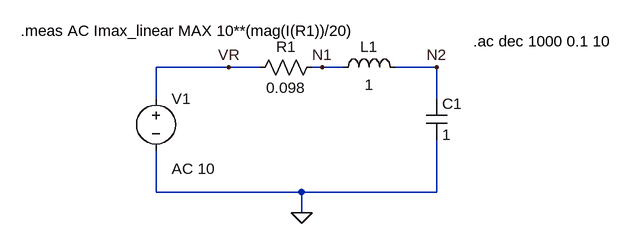
[diagram p0: schematic AC Resistance.asc]
AC Resistance.asc, the LTspice schematic file:
Version 4.1
SHEET 1 916 680
WIRE 96 16 -16 16
WIRE 144 16 96 16
WIRE 240 16 224 16
WIRE 272 16 240 16
WIRE 416 16 352 16
WIRE -16 64 -16 16
WIRE 416 64 416 16
WIRE -16 208 -16 144
WIRE 208 208 -16 208
WIRE 416 208 416 128
WIRE 416 208 208 208
WIRE 208 240 208 208
FLAG 208 240 0
FLAG 240 16 N1
FLAG 416 16 N2
FLAG 96 16 VR
SYMBOL voltage -16 48 R0
WINDOW 123 24 124 Left 2
WINDOW 39 0 0 Left 0
SYMATTR InstName V1
SYMATTR Value ""
SYMATTR Value2 AC 10
SYMBOL res 240 0 R90
WINDOW 0 0 56 VBottom 2
WINDOW 3 32 56 VTop 2
SYMATTR InstName R1
SYMATTR Value 0.098
SYMBOL cap 400 64 R0
SYMATTR InstName C1
SYMATTR Value 1
SYMBOL ind 256 32 R270
WINDOW 0 32 56 VTop 2
WINDOW 3 5 56 VBottom 2
SYMATTR InstName L1
SYMATTR Value 1
TEXT 472 -24 Left 2 !.ac dec 1000 0.1 10
TEXT -224 -40 Left 2 !.meas AC Imax_linear MAX 10**(mag(I(R1))/20)

The netlist it stands for:
* AC Resistance.asc
V1 VR 0 AC 10
R1 N1 VR 0.098
C1 N2 0 1
L1 N1 N2 1
.ac dec 1000 0.1 10
.meas AC Imax_linear MAX 10**(mag(I(R1))/20)
.backanno
.end